# EAGLE design MicrocontrollerBoard_V0.0 (EAGLE 6.4)
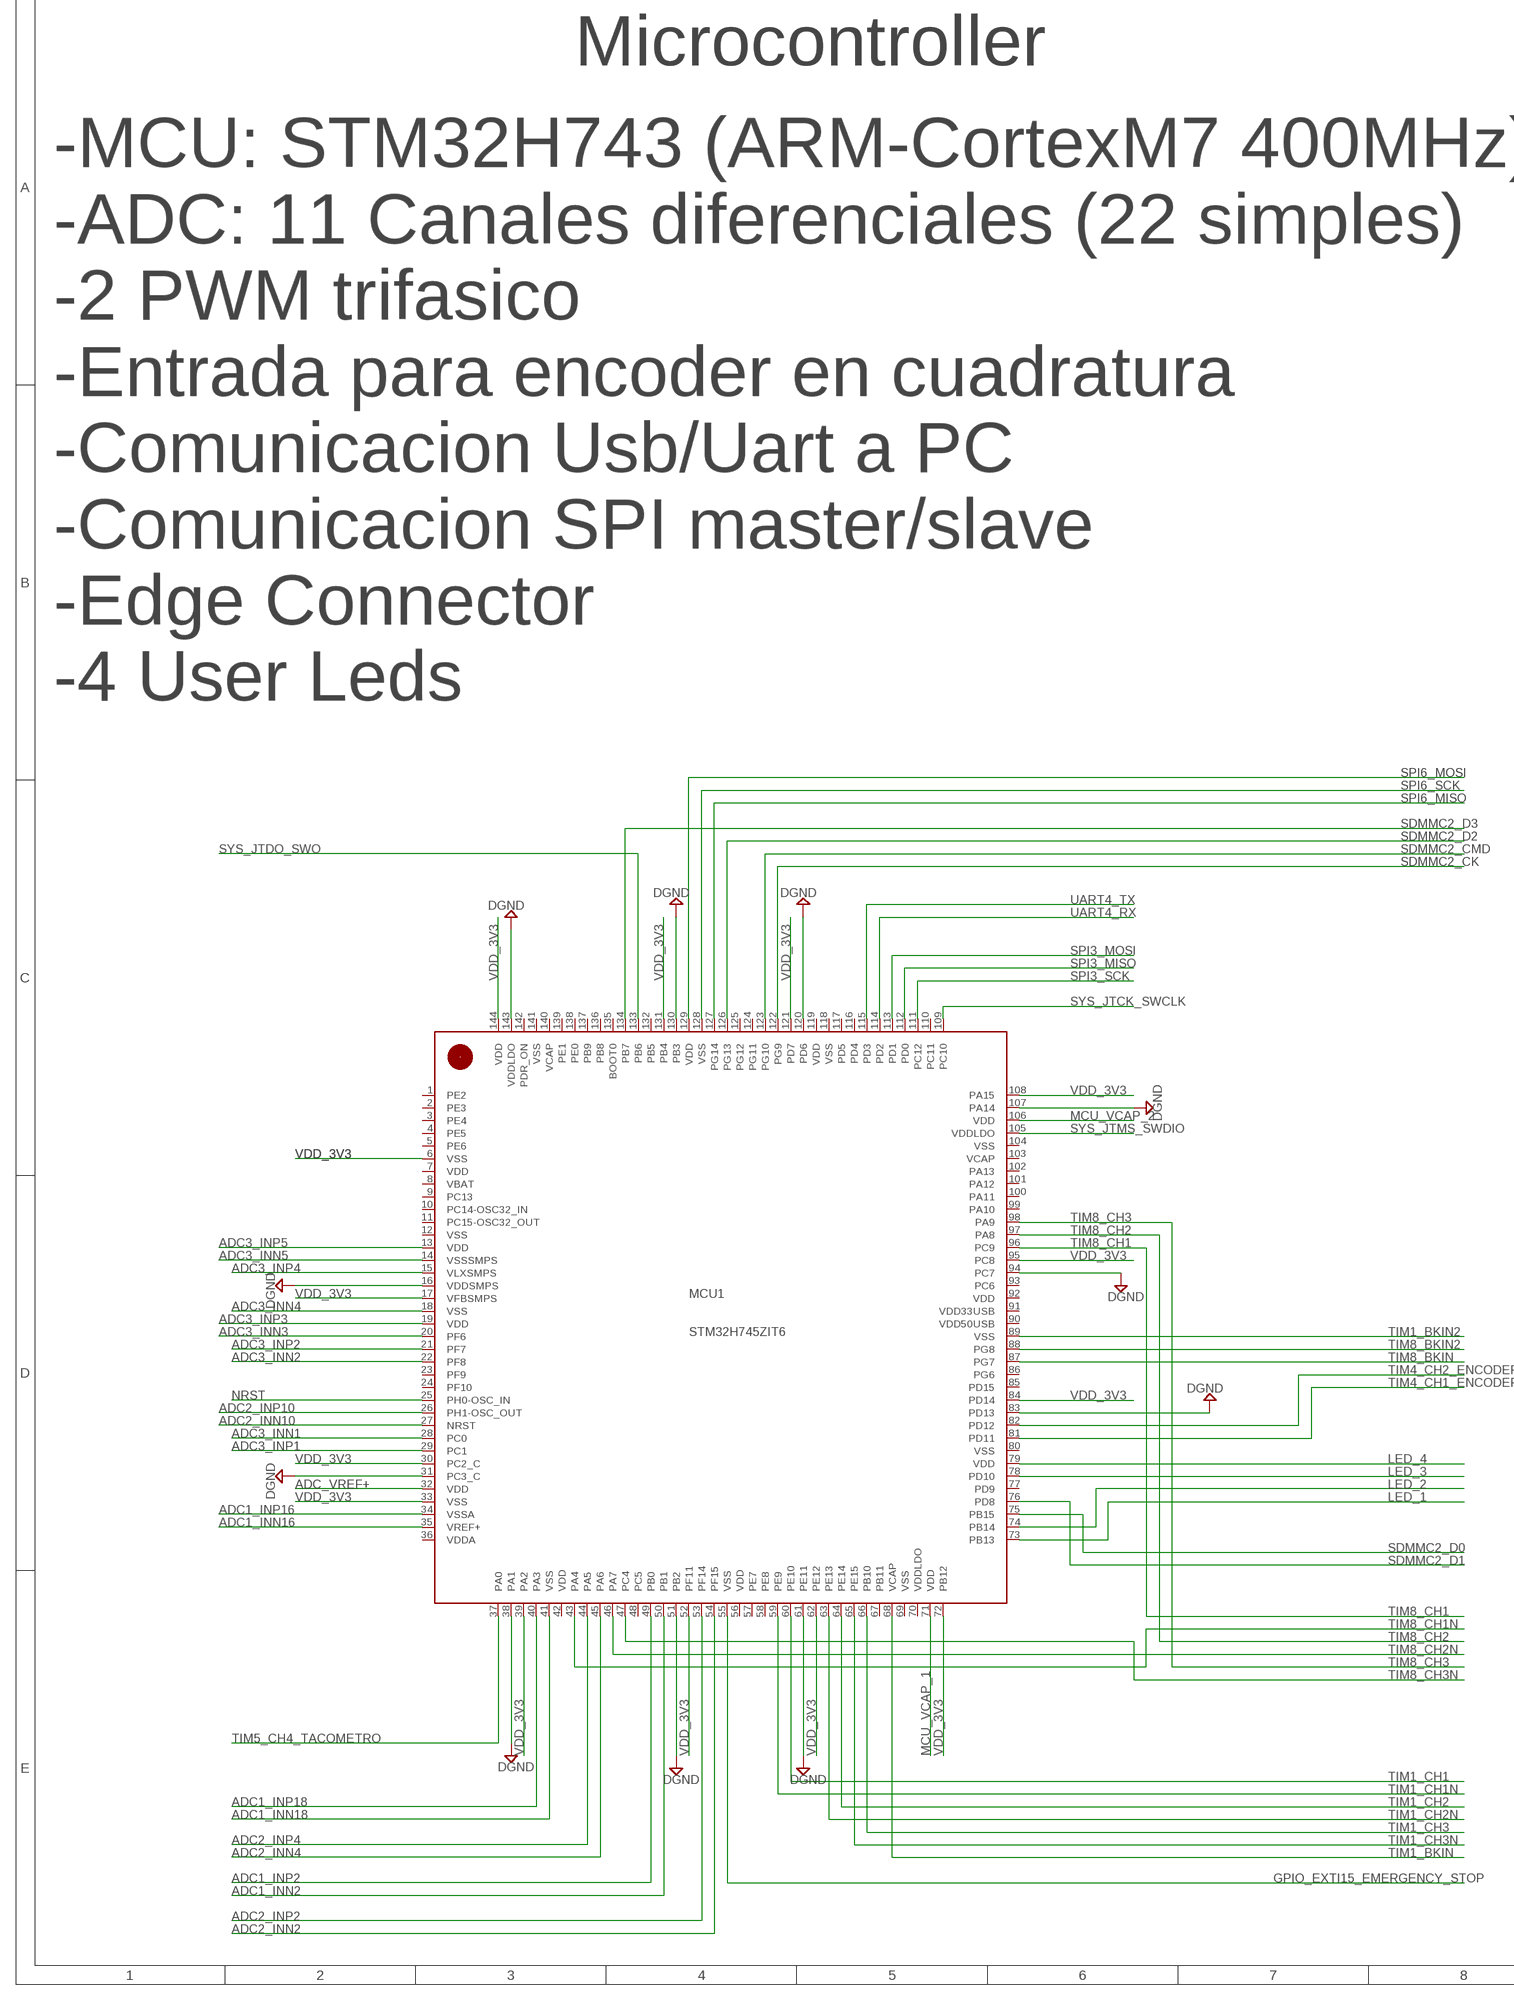
[diagram p0: schematic, sheet 1, part 1 of 2]
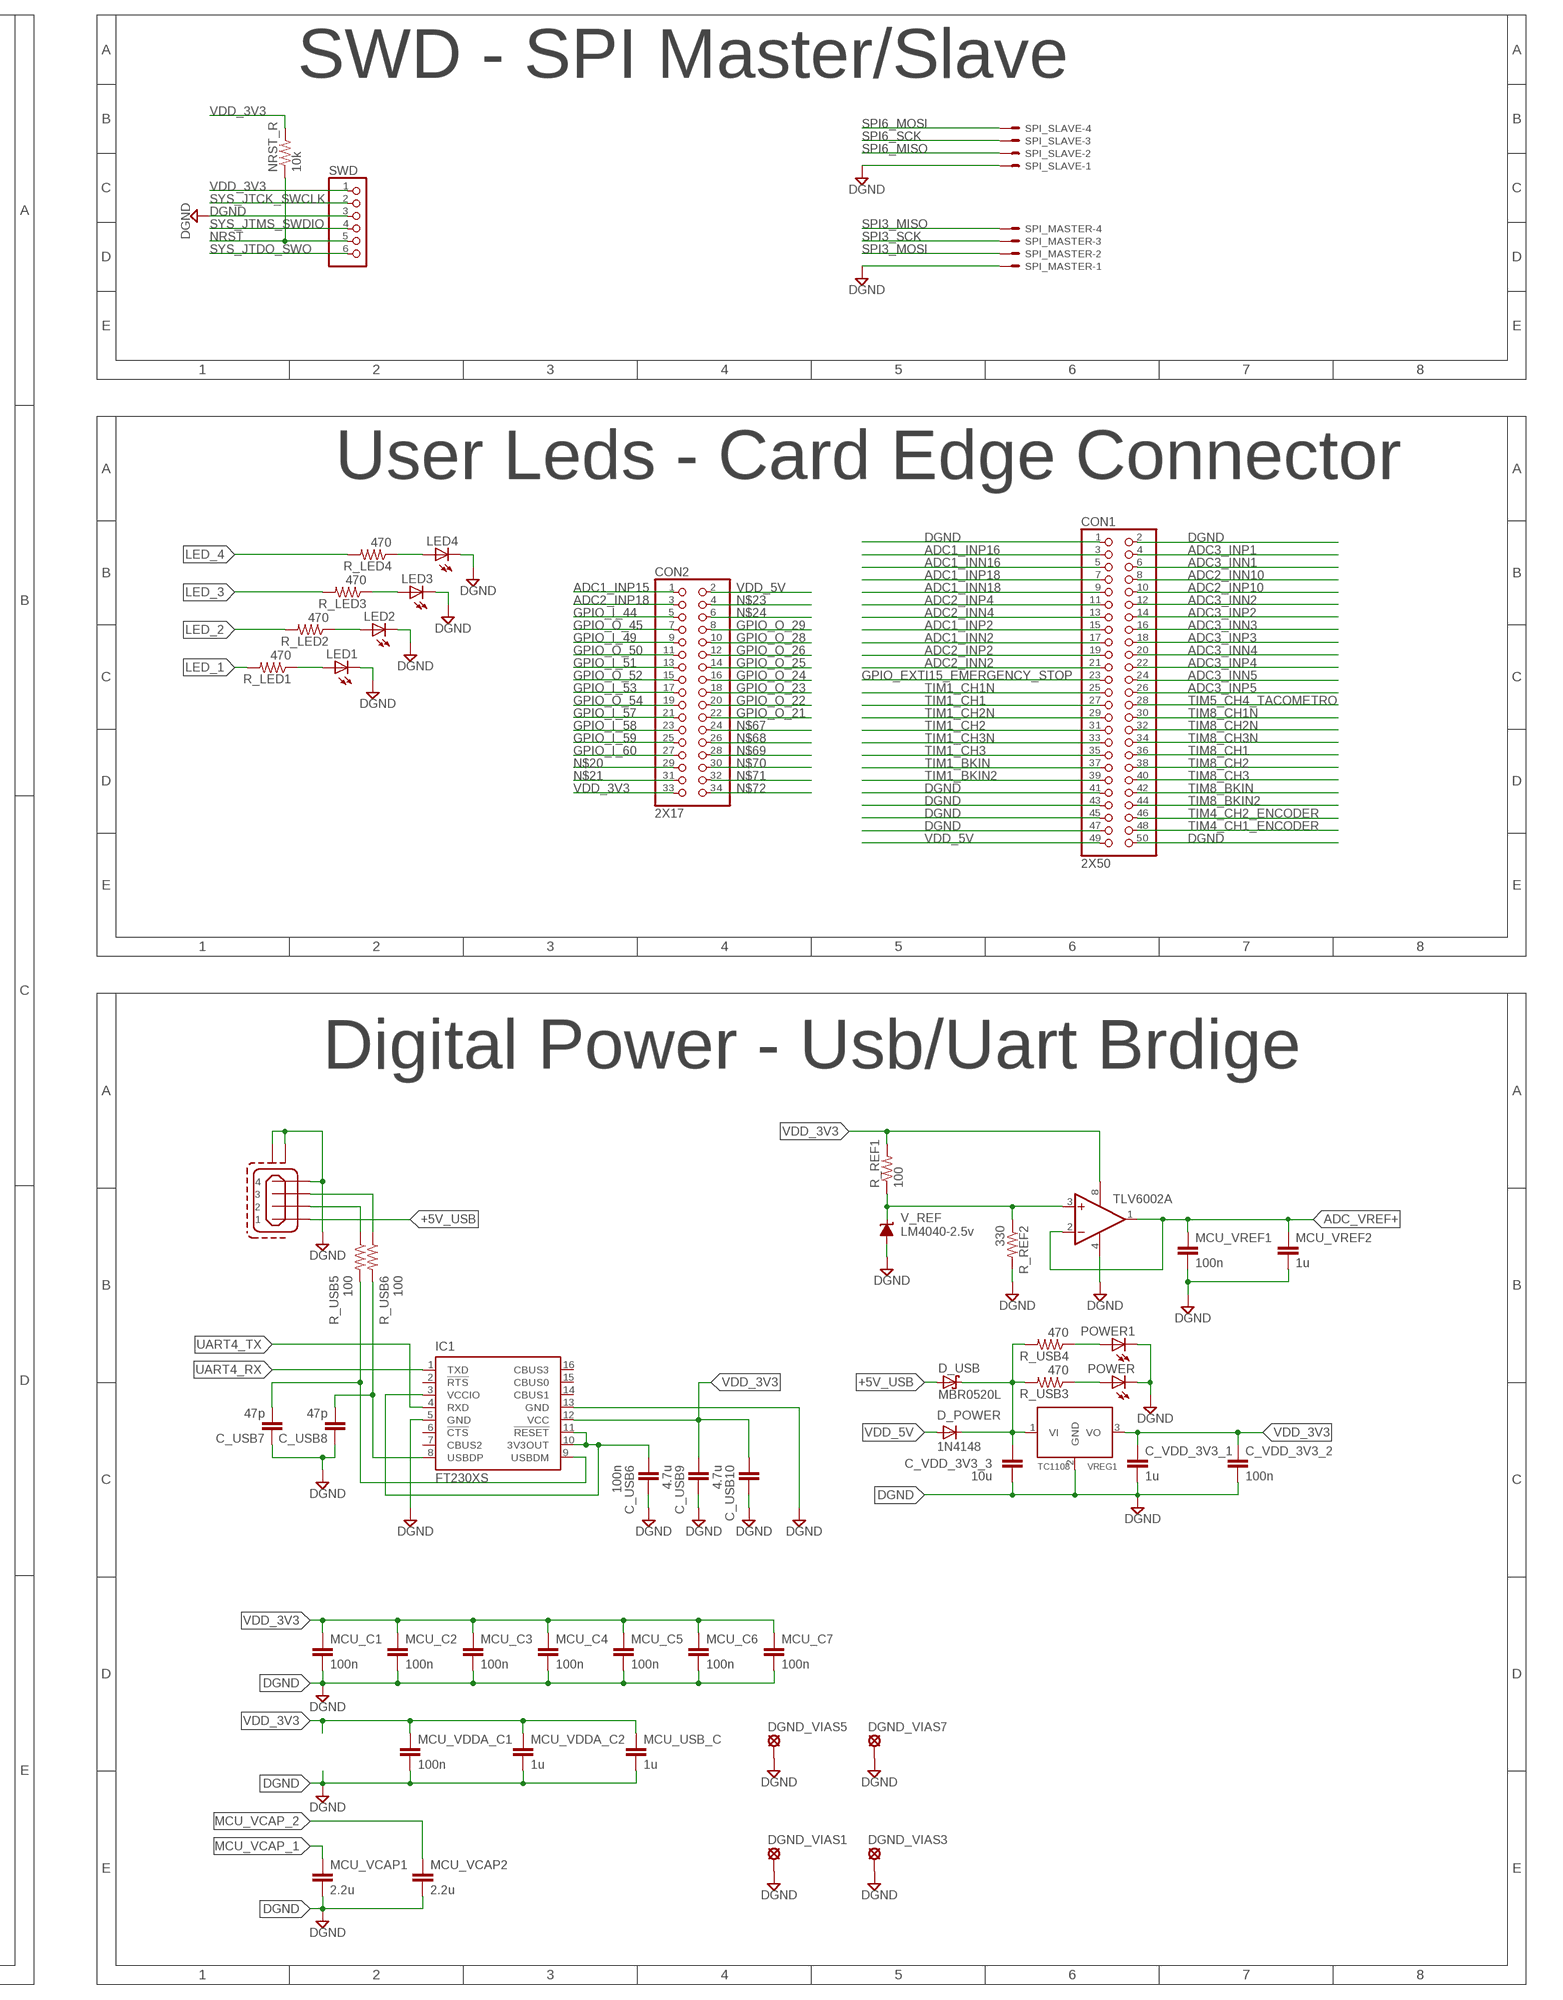
[diagram p1: schematic, sheet 1, part 2 of 2]

## Parts
C_USB6  100n  C-EUC0402  [C0402]
C_USB7  47p  C-EUC0402  [C0402]
C_USB8  47p  C-EUC0402  [C0402]
C_USB9  4.7u  C-EUC0402  [C0402]
C_USB10  4.7u  C-EUC0402  [C0402]
C_VDD_3V3_1  1u  C-EUC0603K  [C0603K]
C_VDD_3V3_2  100n  C-EUC0603K  [C0603K]
C_VDD_3V3_3  10u  C-EUC0603K  [C0603K]
CON1  2X50  [2X25]
CON2  2X17  [2X17]
D_POWER  1N4148  GF1  [SMA-DO214AC]
D_USB  MBR0520L  [SOD-123]
DGND_VIAS1  LSP10  [LSP10]
DGND_VIAS3  LSP10  [LSP10]
DGND_VIAS5  LSP10  [LSP10]
DGND_VIAS7  LSP10  [LSP10]
IC1  FT230XS  [SSOP16]
LED1  LEDCHIPLED_0805  [CHIPLED_0805]
LED2  LEDCHIPLED_0805  [CHIPLED_0805]
LED3  LEDCHIPLED_0805  [CHIPLED_0805]
LED4  LEDCHIPLED_0805  [CHIPLED_0805]
MCU1  STM32H745ZIT6144  [LQFP144]
MCU_C1  100n  C-EUC0402  [C0402]
MCU_C2  100n  C-EUC0402  [C0402]
MCU_C3  100n  C-EUC0402  [C0402]
MCU_C4  100n  C-EUC0402  [C0402]
MCU_C5  100n  C-EUC0402  [C0402]
MCU_C6  100n  C-EUC0402  [C0402]
MCU_C7  100n  C-EUC0402  [C0402]
MCU_USB_C  1u  C-EUC0402  [C0402]
MCU_VCAP1  2.2u  C-EUC0402  [C0402]
MCU_VCAP2  2.2u  C-EUC0402  [C0402]
MCU_VDDA_C1  100n  C-EUC0402  [C0402]
MCU_VDDA_C2  1u  C-EUC0402  [C0402]
MCU_VREF1  100n  C-EUC0402  [C0402]
MCU_VREF2  1u  C-EUC0402  [C0402]
NRST_R  10k  R-US_R0402  [R0402]
POWER  LEDCHIPLED_0805  [CHIPLED_0805]
POWER1  LEDCHIPLED_0805  [CHIPLED_0805]
R_LED1  470  R-US_R0402  [R0402]
R_LED2  470  R-US_R0402  [R0402]
R_LED3  470  R-US_R0402  [R0402]
R_LED4  470  R-US_R0402  [R0402]
R_REF1  100  R-US_R0805  [R0805]
R_REF2  330  R-US_R0805  [R0805]
R_USB3  470  R-US_R0402  [R0402]
R_USB4  470  R-US_R0402  [R0402]
R_USB5  100  R-US_R0402  [R0402]
R_USB6  100  R-US_R0402  [R0402]
SPI_MASTER  22-23-2041  [22-23-2041]
SPI_SLAVE  22-23-2041  [22-23-2041]
SWD  PINHD-1X6/90  [1X06/90]
TLV6002  TL082D  [SO08]
V_REF  LM4040-2.5v  LM4041A12DBZ  [DBZ_R-PDSO-G3]
VREG1  TC1108'SOT-223'  [SOT-223]
X2  MINI-USB_SHIELD4P-85-32004-00X  [85-32004-00X]

## Nets
+5V_USB: D_USB.A(IN) X2.1
ADC1_INN2: CON1.17 MCU1.50(PB1)
ADC1_INN16: CON1.5 MCU1.35(VREF+)
ADC1_INN18: CON1.9 MCU1.41(VSS)
ADC1_INP2: CON1.15 MCU1.49(PB0)
ADC1_INP15: CON2.1
ADC1_INP16: CON1.3 MCU1.34(VSSA)
ADC1_INP18: CON1.7 MCU1.40(PA3)
ADC2_INN2: CON1.21 MCU1.54(PF15)
ADC2_INN4: CON1.13 MCU1.45(PA6)
ADC2_INN10: CON1.8 MCU1.27(NRST)
ADC2_INP2: CON1.19 MCU1.53(PF14)
ADC2_INP4: CON1.11 MCU1.44(PA5)
ADC2_INP10: CON1.10 MCU1.26(PH1-OSC_OUT)
ADC2_INP18: CON2.3
ADC3_INN1: CON1.6 MCU1.28(PC0)
ADC3_INN2: CON1.12 MCU1.22(PF8)
ADC3_INN3: CON1.16 MCU1.20(PF6)
ADC3_INN4: CON1.20 MCU1.18(VSS)
ADC3_INN5: CON1.24 MCU1.14(VSSSMPS)
ADC3_INP1: CON1.4 MCU1.29(PC1)
ADC3_INP2: CON1.14 MCU1.21(PF7)
ADC3_INP3: CON1.18 MCU1.19(VDD)
ADC3_INP4: CON1.22 MCU1.15(VLXSMPS)
ADC3_INP5: CON1.26 MCU1.13(VDD)
ADC_VREF+: MCU1.32(VDD) MCU_VREF1.1 MCU_VREF2.1 TLV6002.1(A:OUT) TLV6002.2(A:-IN)
DGND: C_USB6.1 C_USB7.1 C_USB8.1 C_USB9.1 C_USB10.1 C_VDD_3V3_1.2 C_VDD_3V3_2.2 C_VDD_3V3_3.2 CON1.1 CON1.2 CON1.41 CON1.43 CON1.45 CON1.47 CON1.50 DGND_VIAS1.MP DGND_VIAS3.MP DGND_VIAS5.MP DGND_VIAS7.MP IC1.5(GND) IC1.13(GND) LED1.C LED2.C LED3.C LED4.C MCU1.16(VDDSMPS) MCU1.31(PC3_C) MCU1.38(PA1) MCU1.51(PB2) MCU1.61(PE11) MCU1.83(PD13) MCU1.94(PC7) MCU1.107(PA14) MCU1.120(PD6) MCU1.130(PB3) MCU1.143(VDDLDO) MCU_C1.2 MCU_C2.2 MCU_C3.2 MCU_C4.2 MCU_C5.2 MCU_C6.2 MCU_C7.2 MCU_USB_C.2 MCU_VCAP1.2 MCU_VCAP2.2 MCU_VDDA_C1.2 MCU_VDDA_C2.2 MCU_VREF1.2 MCU_VREF2.2 POWER1.C POWER.C R_REF2.2 SPI_MASTER.1 SPI_SLAVE.1 SWD.3 TLV6002.4(P:V-) V_REF.2(A) VREG1.2(GND) X2.4 X2.M1(S1) X2.M2(S2)
GPIO_EXTI15_EMERGENCY_STOP: CON1.23 MCU1.55(VSS)
GPIO_I_44: CON2.5
GPIO_I_49: CON2.9
GPIO_I_51: CON2.13
GPIO_I_53: CON2.17
GPIO_I_57: CON2.21
GPIO_I_58: CON2.23
GPIO_I_59: CON2.25
GPIO_I_60: CON2.27
GPIO_O_21: CON2.22
GPIO_O_22: CON2.20
GPIO_O_23: CON2.18
GPIO_O_24: CON2.16
GPIO_O_25: CON2.14
GPIO_O_26: CON2.12
GPIO_O_28: CON2.10
GPIO_O_29: CON2.8
GPIO_O_45: CON2.7
GPIO_O_50: CON2.11
GPIO_O_52: CON2.15
GPIO_O_54: CON2.19
LED_1: MCU1.73(PB13) R_LED1.2
LED_2: MCU1.74(PB14) R_LED2.2
LED_3: MCU1.78(PD10) R_LED3.2
LED_4: MCU1.79(VDD) R_LED4.2
MCU_VCAP_1: MCU1.71(VDD) MCU_VCAP1.1
MCU_VCAP_2: MCU1.106(VDD) MCU_VCAP2.1
N$2: LED4.A R_LED4.1
N$7: POWER1.A R_USB4.1
N$11: LED3.A R_LED3.1
N$12: C_USB6.2 IC1.3(VCCIO) IC1.10(3V3OUT) IC1.11(!RESET)
N$15: C_VDD_3V3_3.1 D_POWER.K(C) D_USB.C(OUT) R_USB3.2 R_USB4.2 VREG1.1(VI)
N$16: C_USB8.2 IC1.8(USBDP) R_USB6.2
N$17: C_USB7.2 IC1.9(USBDM) R_USB5.2
N$20: CON2.29
N$21: CON2.31
N$23: CON2.4
N$24: CON2.6
N$67: CON2.24
N$68: CON2.26
N$69: CON2.28
N$70: CON2.30
N$71: CON2.32
N$72: CON2.34
N$133: R_USB5.1 X2.2
N$134: R_USB6.1 X2.3
N$138: POWER.A R_USB3.1
N$144: R_REF1.1 R_REF2.1 TLV6002.3(A:+IN) V_REF.1(C)
N$147: LED1.A R_LED1.1
N$154: LED2.A R_LED2.1
NRST: MCU1.25(PH0-OSC_IN) NRST_R.1 SWD.5
SDMMC2_CK: MCU1.122(PG9)
SDMMC2_CMD: MCU1.123(PG10)
SDMMC2_D0: MCU1.75(PB15)
SDMMC2_D1: MCU1.76(PD8)
SDMMC2_D2: MCU1.126(PG13)
SDMMC2_D3: MCU1.134(PB7)
SPI3_MISO: MCU1.112(PD0) SPI_MASTER.4
SPI3_MOSI: MCU1.113(PD1) SPI_MASTER.2
SPI3_SCK: MCU1.111(PC12) SPI_MASTER.3
SPI6_MISO: MCU1.127(PG14) SPI_SLAVE.2
SPI6_MOSI: MCU1.129(VDD) SPI_SLAVE.4
SPI6_SCK: MCU1.128(VSS) SPI_SLAVE.3
SYS_JTCK_SWCLK: MCU1.109(PC10) SWD.2
SYS_JTDO_SWO: MCU1.133(PB6) SWD.6
SYS_JTMS_SWDIO: MCU1.105(VDDLDO) SWD.4
TIM1_BKIN: CON1.37 MCU1.68(VCAP)
TIM1_BKIN2: CON1.39 MCU1.89(VSS)
TIM1_CH1: CON1.27 MCU1.60(PE10)
TIM1_CH1N: CON1.25 MCU1.59(PE9)
TIM1_CH2: CON1.31 MCU1.64(PE14)
TIM1_CH2N: CON1.29 MCU1.63(PE13)
TIM1_CH3: CON1.35 MCU1.66(PB10)
TIM1_CH3N: CON1.33 MCU1.65(PE15)
TIM4_CH1_ENCODER: CON1.48 MCU1.81(PD11)
TIM4_CH2_ENCODER: CON1.46 MCU1.82(PD12)
TIM5_CH4_TACOMETRO: CON1.28 MCU1.37(PA0)
TIM8_BKIN: CON1.42 MCU1.87(PG7)
TIM8_BKIN2: CON1.44 MCU1.88(PG8)
TIM8_CH1: CON1.36 MCU1.96(PC9)
TIM8_CH1N: CON1.30 MCU1.43(PA4)
TIM8_CH2: CON1.38 MCU1.97(PA8)
TIM8_CH2N: CON1.32 MCU1.46(PA7)
TIM8_CH3: CON1.40 MCU1.98(PA9)
TIM8_CH3N: CON1.34 MCU1.47(PC4)
UART4_RX: IC1.1(TXD) MCU1.114(PD2)
UART4_TX: IC1.4(RXD) MCU1.115(PD3)
VDD_3V3: C_USB9.2 C_USB10.2 C_VDD_3V3_1.1 C_VDD_3V3_2.1 CON2.33 IC1.12(VCC) MCU1.6(VSS) MCU1.17(VFBSMPS) MCU1.30(PC2_C) MCU1.33(VSS) MCU1.39(PA2) MCU1.52(PF11) MCU1.62(PE12) MCU1.72(PB12) MCU1.84(PD14) MCU1.95(PC8) MCU1.108(PA15) MCU1.121(PD7) MCU1.131(PB4) MCU1.144(VDD) MCU_C1.1 MCU_C2.1 MCU_C3.1 MCU_C4.1 MCU_C5.1 MCU_C6.1 MCU_C7.1 MCU_USB_C.1 MCU_VDDA_C1.1 MCU_VDDA_C2.1 NRST_R.2 R_REF1.2 SWD.1 TLV6002.8(P:V+) VREG1.3(VO)
VDD_5V: CON1.49 CON2.2 D_POWER.A
Unconnected: IC1.2(!RTS) IC1.6(!CTS) IC1.7(CBUS2) IC1.14(CBUS1) IC1.15(CBUS0) IC1.16(CBUS3) MCU1.1(PE2) MCU1.2(PE3) MCU1.3(PE4) MCU1.4(PE5) MCU1.5(PE6) MCU1.7(VDD) MCU1.8(VBAT) MCU1.9(PC13) MCU1.10(PC14-OSC32_IN) MCU1.11(PC15-OSC32_OUT) MCU1.12(VSS) MCU1.23(PF9) MCU1.24(PF10) MCU1.36(VDDA) MCU1.42(VDD) MCU1.48(PC5) MCU1.56(VDD) MCU1.57(PE7) MCU1.58(PE8) MCU1.67(PB11) MCU1.69(VSS) MCU1.70(VDDLDO) MCU1.77(PD9) MCU1.80(VSS) MCU1.85(PD15) MCU1.86(PG6) MCU1.90(VDD50USB) MCU1.91(VDD33USB) MCU1.92(VDD) MCU1.93(PC6) MCU1.99(PA10) MCU1.100(PA11) MCU1.101(PA12) MCU1.102(PA13) MCU1.103(VCAP) MCU1.104(VSS) MCU1.110(PC11) MCU1.116(PD4) MCU1.117(PD5) MCU1.118(VSS) MCU1.119(VDD) MCU1.124(PG11) MCU1.125(PG12) MCU1.132(PB5) MCU1.135(BOOT0) MCU1.136(PB8) MCU1.137(PB9) MCU1.138(PE0) MCU1.139(PE1) MCU1.140(VCAP) MCU1.141(VSS) MCU1.142(PDR_ON) TLV6002.5(B:+IN) TLV6002.6(B:-IN) TLV6002.7(B:OUT)

## Notes on the sheet
- Microcontroller | SWD - SPI Master/Slave
- User Leds - Card Edge Connector
- -MCU: STM32H743 (ARM-CortexM7 400MHz)
  -ADC: 11 Canales diferenciales (22 simples)
  -2 PWM trifasico
  -Entrada para encoder en cuadratura
  -Comunicacion Usb/Uart a PC
  -Comunicacion SPI master/slave
  -Edge Connector
  -4 User Leds
- Digital Power - Usb/Uart Brdige

## Library data of the parts
C_USB6-C_USB10 C_VDD_3V3_1-C_VDD_3V3_3 MCU_C1-MCU_C7 MCU_USB_C MCU_VCAP1 MCU_VCAP2 MCU_VDDA_C1 MCU_VDDA_C2 MCU_VREF1 MCU_VREF2 = rcl:C-EU: CAPACITOR, European symbol
CON1 = CardEdgePads:2X50
CON2 = CardEdgePads:2X17
D_POWER = diode:GF1: DIODE
D_USB = MBR:MBR0520L: The MBR0520L is a Schottky Rectifier whit Low Forward Voltage.
DGND_VIAS1 DGND_VIAS3 DGND_VIAS5 DGND_VIAS7 = solpad:LSP10: SOLDER PAD drill 1.0 mm, distributor Buerklin, 12H555
IC1 = ftdichip:FT230X: USB to BASIC UART IC Auto generated by make-symbol-device-package-bsdl.ulp Rev. 43 Source: Data sheet <http://www.ftdichip.com/Support/Documents/DataSheets/ICs/DS_FT230X.pdf>
LED1-LED4 POWER POWER1 = led:LED: LED OSRAM: - CHIPLED LG R971, LG N971, LY N971, LG Q971, LY Q971, LO R971, LY R971 LH N974, LH R974 LS Q976, LO Q976, LY Q976 LO Q996 - Hyper CHIPLED LW Q18S LB Q993, LB Q99A, LB R99A - SideLED LS A670, LO A670, LY A670, LG A670, LP A670 LB A673, LV A673, LT A673, LW A673 LH A674 LY A675 LS A676, LA A676, LO A676, LY A676, LW A676 LS A679, LY A679, LG A679 - Hyper Micro SIDELED® LS Y876, LA Y876, LO Y876, LY Y876 LT Y87S - SmartLED LW L88C, LW L88S LB L89C, LB L89S, LG L890 LS L89K, LO L89K, LY L89K LS L896, LA L896, LO L896, LY L896 - TOPLED LS T670, LO T670, LY T670, LG T670, LP T670 LSG T670, LSP T670, LSY T670, LOP T670, LYG T670 LG T671, LOG T671, LSG T671 LB T673, LV T673, LT T673, LW T673 LH T674 LS T676, LA T676, LO T676, LY T676, LB T676, LH T676, LSB T676, LW T676 LB T67C, LV T67C, LT T67C, LS T67K, LO T67K, LY T67K, LW E67C LS E67B, LA E67B, LO E67B, LY E67B, LB E67C, LV E67C, LT E67C LW T67C LS T679, LY T679, LG T679 LS T770, LO T770, LY T770, LG T770, LP T770 LB T773, LV T773, LT T773, LW T773 LH T774 LS E675, LA E675, LY E675, LS T675 LS T776, LA T776, LO T776, LY T776, LB T776 LHGB T686 LT T68C, LB T68C - Hyper Mini TOPLED® LB M676 - Mini TOPLED Santana® LG M470 LS M47K, LO M47K, LY M47K Source: http://www.osram.convergy.de LUXEON: - LUMILED® LXK2-PW12-R00, LXK2-PW12-S00, LXK2-PW14-U00, LXK2-PW14-V00 LXK2-PM12-R00, LXK2-PM12-S00, LXK2-PM14-U00 LXK2-PE12-Q00, LXK2-PE12-R00, LXK2-PE12-S00, LXK2-PE14-T00, LXK2-PE14-U00 LXK2-PB12-K00, LXK2-PB12-L00, LXK2-PB12-M00, LXK2-PB14-N00, LXK2-PB14-P00, LXK2-PB14-Q00 LXK2-PR12-L00, LXK2-PR12-M00, LXK2-PR14-Q00, LXK2-PR14-R00 LXK2-PD12-Q00, LXK2-PD12-R00, LXK2-PD12-S00 LXK2-PH12-R00, LXK2-PH12-S00 LXK2-PL12-P00, LXK2-PL12-Q00, LXK2-PL12-R00 Source: www.luxeon.com KINGBRIGHT: KA-3528ASYC Source: www.kingbright.com
MCU1 = STM32H745ZIT6:STM32H745ZIT6
NRST_R R_LED1-R_LED4 R_REF1 R_REF2 R_USB3-R_USB6 = rcl:R-US_: RESISTOR, American symbol
SPI_MASTER SPI_SLAVE = con-molex:22-23-2041: .100" (2.54mm) Center Header - 4 Pin; MF: MOLEX; MPN: 22-23-2041; OC_FARNELL: 1462920; OC_NEWARK: 38C0355
SWD = pinhead:PINHD-1X6: PIN HEADER
TLV6002 = linear:TL082: OP AMP
V_REF = texas:LM4041: PRECISION MICROPOWER SHUNT VOLTAGE REFERENCE Source: http://focus.ti.com/lit/ds/slcs146e/slcs146e.pdf; MPN: LM4041A12IDBZR; OC_FARNELL: 1407949; OC_NEWARK: 58K5875
VREG1 = TC1108:TC1108
X2 = con-cypressindustries:MINI-USB_SHIELD4P-: MINI USB 4 Pol. Source: www.cypressindustries.com; OC_FARNELL: unknown; OC_NEWARK: unknown

## Board
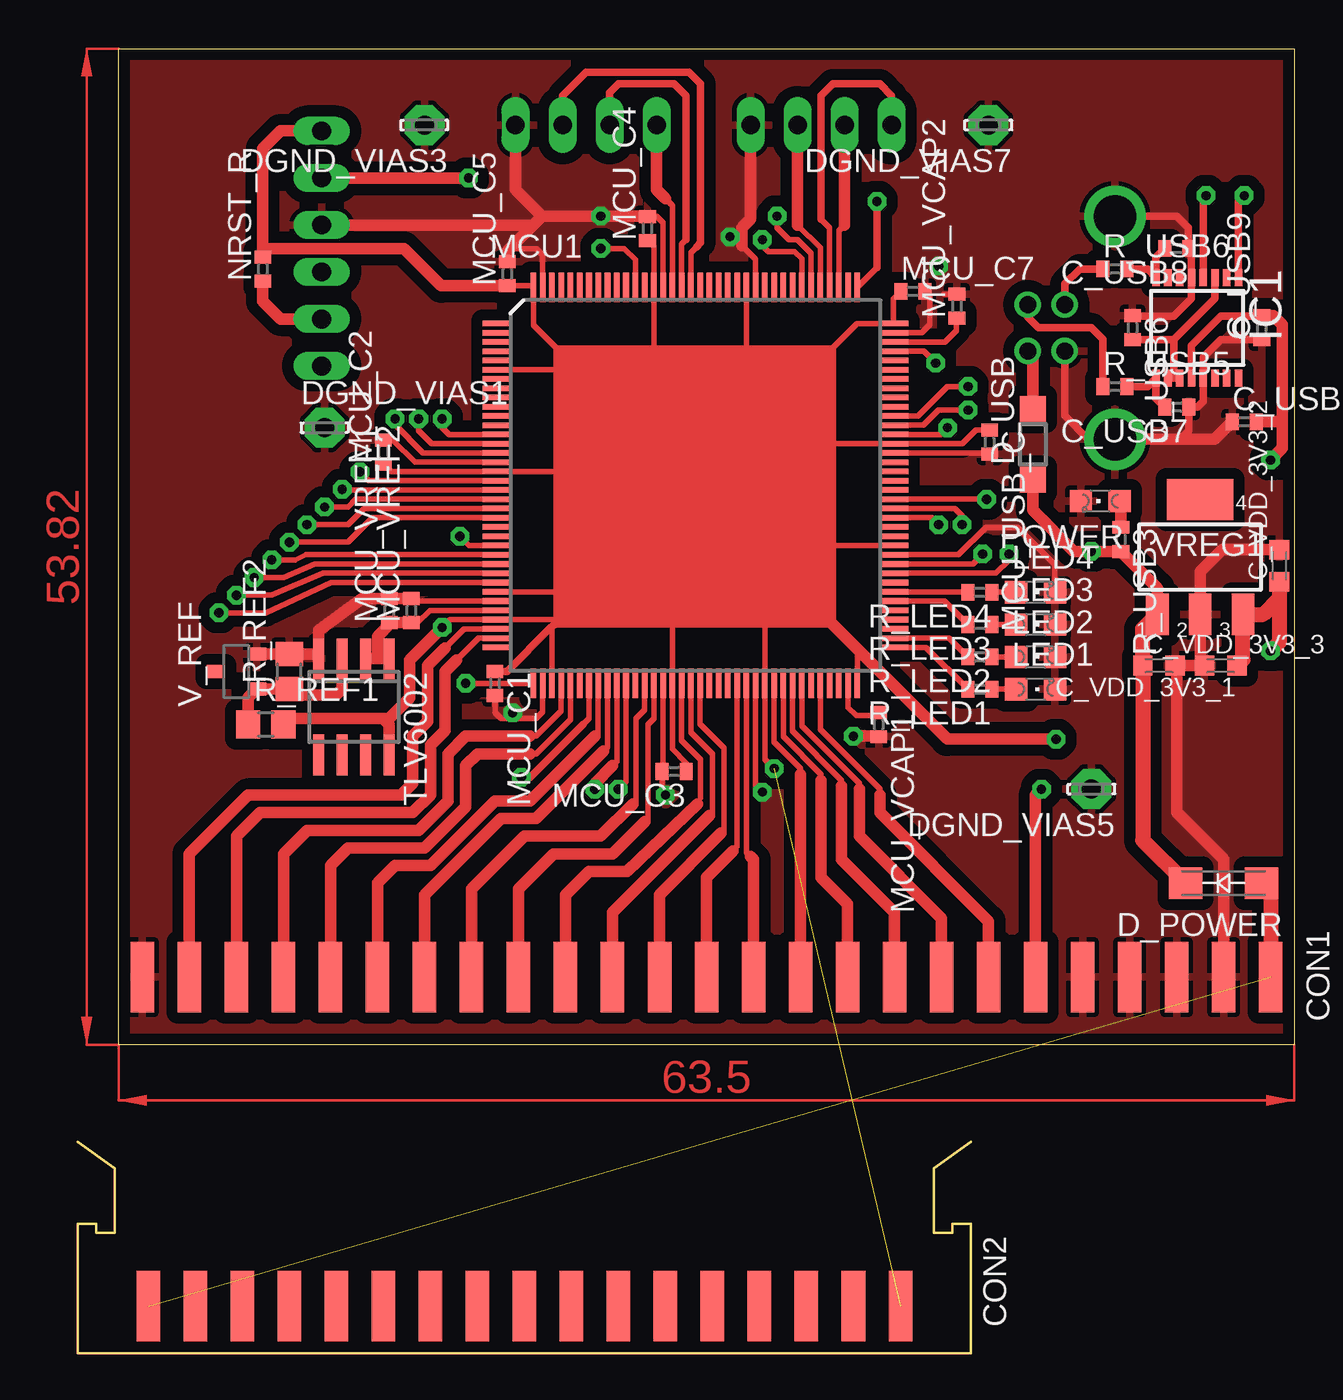
[diagram p2: board, top side]
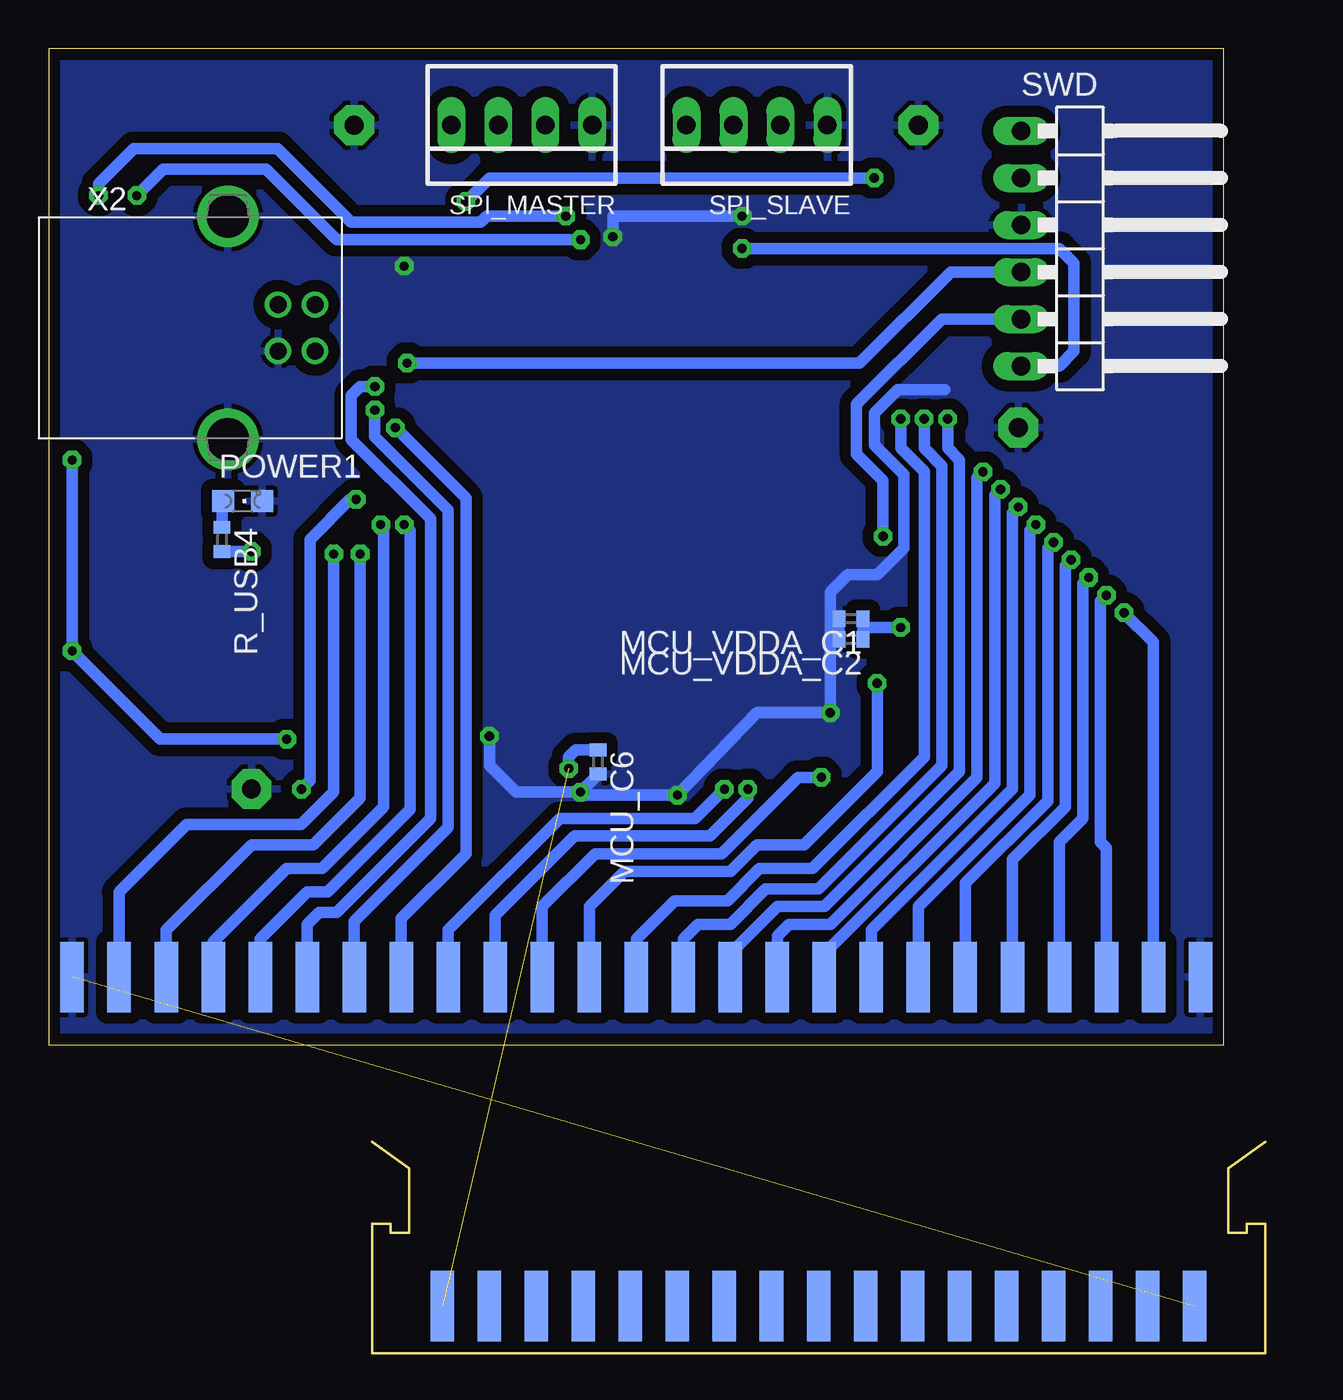
[diagram p3: board, bottom side, seen from below]

Size 63.5 x 53.82 mm. Coordinates in mm from the lower left corner, seen from the top.
Outline: 0,0 0,53.82 63.5,53.82 63.5,0 0,0
Copper layers (1*16): Top 0.035mm / dielectric 1.5mm / Bottom 0.035mm
Design rules "mayer_estandar": minimum track width 5mil, minimum drill 16mil, track to track 5mil, track to pad 5mil, pad to pad 8mil, via to via 8mil, smd to smd 8mil, copper to edge 12mil, drill to drill 8mil, minimum pad ring 10mil, minimum via ring 8mil, stop-mask expansion 4mil, vias tented up to drill 0mil, thermal gap 10mil

### Footprints (pad centres in the part's own frame; a part is rotated, then mirrored left to right if it is on the bottom)
C0402 = smd 0.7 x 0.9: 1 -0.65,0; 2 0.65,0
C0603K = smd 1.05 x 1.08: 1 -0.875,0; 2 0.875,0
2X25 = smd 1.27 x 3.81: 1 -30.48,0; 3 -27.94,0; 5 -25.4,0; 7 -22.86,0; 9 -20.32,0; 11 -17.78,0; 13 -15.24,0; 15 -12.7,0; 17 -10.16,0; 19 -7.62,0; 21 -5.08,0; 23 -2.54,0; 25 0,0; 27 2.54,0; 29 5.08,0; 31 7.62,0; 33 10.16,0; 35 12.7,0; 37 15.24,0; 39 17.78,0; 41 20.32,0; 43 22.86,0; 45 25.4,0; 47 27.94,0; 49 30.48,0 | smd 1.27 x 3.81 bottom: 2 -30.48,0; 4 -27.94,0; 6 -25.4,0; 8 -22.86,0; 10 -20.32,0; 12 -17.78,0; 14 -15.24,0; 16 -12.7,0; 18 -10.16,0; 20 -7.62,0; 22 -5.08,0; 24 -2.54,0; 26 0,0; 28 2.54,0; 30 5.08,0; 32 7.62,0; 34 10.16,0; 36 12.7,0; 38 15.24,0; 40 17.78,0; 42 20.32,0; 44 22.86,0; 46 25.4,0; 48 27.94,0; 50 30.48,0
2X17 = smd 1.27 x 3.81: 1 -20.32,0; 3 -17.78,0; 5 -15.24,0; 7 -12.7,0; 9 -10.16,0; 11 -7.62,0; 13 -5.08,0; 15 -2.54,0; 17 0,0; 19 2.54,0; 21 5.08,0; 23 7.62,0; 25 10.16,0; 27 12.7,0; 29 15.24,0; 31 17.78,0; 33 20.32,0 | smd 1.27 x 3.81 bottom: 2 -20.32,0; 4 -17.78,0; 6 -15.24,0; 8 -12.7,0; 10 -10.16,0; 12 -7.62,0; 14 -5.08,0; 16 -2.54,0; 18 0,0; 20 2.54,0; 22 5.08,0; 24 7.62,0; 26 10.16,0; 28 12.7,0; 30 15.24,0; 32 17.78,0; 34 20.32,0
SMA-DO214AC = smd 1.8 x 1.7: A -2.05,0; K 2.05,0
SOD-123 = smd 1.4 x 1.4: A 1.8,0; C -2,0
LSP10 = drill 1.016 pad 2.159 octagon: MP 0,0
SSOP16 = smd 0.914 x 0.406: 1 -2.718,2.223; 2 -2.718,1.587; 3 -2.718,0.953; 4 -2.718,0.318; 5 -2.718,-0.318; 6 -2.718,-0.953; 7 -2.718,-1.587; 8 -2.718,-2.223; 9 2.718,-2.223; 10 2.718,-1.587; 11 2.718,-0.953; 12 2.718,-0.318; 13 2.718,0.318; 14 2.718,0.953; 15 2.718,1.587; 16 2.718,2.223
CHIPLED_0805 = smd 1.2 x 1.2: A 0,-1.05; C 0,1.05
LQFP144 = smd 1.6 x 0.3: 1 -10.7,8.75; 2 -10.7,8.25; 3 -10.7,7.75; 4 -10.7,7.25; 5 -10.7,6.75; 6 -10.7,6.25; 7 -10.7,5.75; 8 -10.7,5.25; 9 -10.7,4.75; 10 -10.7,4.25; 11 -10.7,3.75; 12 -10.7,3.25; 13 -10.7,2.75; 14 -10.7,2.25; 15 -10.7,1.75; 16 -10.7,1.25; 17 -10.7,0.75; 18 -10.7,0.25; 19 -10.7,-0.25; 20 -10.7,-0.75; 21 -10.7,-1.25; 22 -10.7,-1.75; 23 -10.7,-2.25; 24 -10.7,-2.75; 25 -10.7,-3.25; 26 -10.7,-3.75; 27 -10.7,-4.25; 28 -10.7,-4.75; 29 -10.7,-5.25; 30 -10.7,-5.75; 31 -10.7,-6.25; 32 -10.7,-6.75; 33 -10.7,-7.25; 34 -10.7,-7.75; 35 -10.7,-8.25; 36 -10.7,-8.75; 73 10.7,-8.75; 74 10.7,-8.25; 75 10.7,-7.75; 76 10.7,-7.25; 77 10.7,-6.75; 78 10.7,-6.25; 79 10.7,-5.75; 80 10.7,-5.25; 81 10.7,-4.75; 82 10.7,-4.25; 83 10.7,-3.75; 84 10.7,-3.25; 85 10.7,-2.75; 86 10.7,-2.25; 87 10.7,-1.75; 88 10.7,-1.25; 89 10.7,-0.75; 90 10.7,-0.25; 91 10.7,0.25; 92 10.7,0.75; 93 10.7,1.25; 94 10.7,1.75; 95 10.7,2.25; 96 10.7,2.75; 97 10.7,3.25; 98 10.7,3.75; 99 10.7,4.25; 100 10.7,4.75; 101 10.7,5.25; 102 10.7,5.75; 103 10.7,6.25; 104 10.7,6.75; 105 10.7,7.25; 106 10.7,7.75; 107 10.7,8.25; 108 10.7,8.75 | smd 0.3 x 1.6: 37 -8.75,-10.7; 38 -8.25,-10.7; 39 -7.75,-10.7; 40 -7.25,-10.7; 41 -6.75,-10.7; 42 -6.25,-10.7; 43 -5.75,-10.7; 44 -5.25,-10.7; 45 -4.75,-10.7; 46 -4.25,-10.7; 47 -3.75,-10.7; 48 -3.25,-10.7; 49 -2.75,-10.7; 50 -2.25,-10.7; 51 -1.75,-10.7; 52 -1.25,-10.7; 53 -0.75,-10.7; 54 -0.25,-10.7; 55 0.25,-10.7; 56 0.75,-10.7; 57 1.25,-10.7; 58 1.75,-10.7; 59 2.25,-10.7; 60 2.75,-10.7; 61 3.25,-10.7; 62 3.75,-10.7; 63 4.25,-10.7; 64 4.75,-10.7; 65 5.25,-10.7; 66 5.75,-10.7; 67 6.25,-10.7; 68 6.75,-10.7; 69 7.25,-10.7; 70 7.75,-10.7; 71 8.25,-10.7; 72 8.75,-10.7; 109 8.75,10.7; 110 8.25,10.7; 111 7.75,10.7; 112 7.25,10.7; 113 6.75,10.7; 114 6.25,10.7; 115 5.75,10.7; 116 5.25,10.7; 117 4.75,10.7; 118 4.25,10.7; 119 3.75,10.7; 120 3.25,10.7; 121 2.75,10.7; 122 2.25,10.7; 123 1.75,10.7; 124 1.25,10.7; 125 0.75,10.7; 126 0.25,10.7; 127 -0.25,10.7; 128 -0.75,10.7; 129 -1.25,10.7; 130 -1.75,10.7; 131 -2.25,10.7; 132 -2.75,10.7; 133 -3.25,10.7; 134 -3.75,10.7; 135 -4.25,10.7; 136 -4.75,10.7; 137 -5.25,10.7; 138 -5.75,10.7; 139 -6.25,10.7; 140 -6.75,10.7; 141 -7.25,10.7; 142 -7.75,10.7; 143 -8.25,10.7; 144 -8.75,10.7
R0402 = smd 0.7 x 0.9: 1 -0.65,0; 2 0.65,0
R0805 = smd 1.3 x 1.5: 1 -0.95,0; 2 0.95,0
22-23-2041 = drill 1 long: 1 -3.81,0; 2 -1.27,0; 3 1.27,0; 4 3.81,0
1X06/90 = drill 1.016 long: 1 -6.35,-3.81; 2 -3.81,-3.81; 3 -1.27,-3.81; 4 1.27,-3.81; 5 3.81,-3.81; 6 6.35,-3.81
SO08 = smd 0.6 x 2.2: 1 -1.905,-2.6; 2 -0.635,-2.6; 3 0.635,-2.6; 4 1.905,-2.6; 5 1.905,2.6; 6 0.635,2.6; 7 -0.635,2.6; 8 -1.905,2.6
DBZ_R-PDSO-G3 = smd 0.7 x 1: 1 -0.95,-1.1; 2 0.95,-1.1; 3 0,1.1
SOT-223 = smd 1.219 x 2.235: 1 -2.311,-3.099; 2 0,-3.099; 3 2.311,-3.099 | smd 3.6 x 2.2: 4 0,3.099
85-32004-00X = drill 0.92 pad 1.27: 1 4.71,-1.25; 2 4.71,1.25; 3 2.71,1.25; 4 2.71,-1.25 | drill 2.3 pad 3: M1 0,6.02; M2 0,-6.02

### Placement (x,y rotation side)
C_USB6  54.77,38.73 270 top
C_USB7  57.15,34.45 180 top
C_USB8  57.15,43.02 180 top
C_USB9  61.75,38.73 90 top
C_USB10  60.8,33.66 0 top
C_VDD_3V3_1  59.53,20.48 180 top
C_VDD_3V3_2  62.71,25.88 90 top
C_VDD_3V3_3  56.2,20.48 0 top
CON1  31.75,3.65 0 top
CON2  21.91,-14.13 0 top  (outside the outline)
D_POWER  59.69,8.73 180 top
D_USB  49.37,32.54 90 top
DGND_VIAS1  11.11,33.34 0 top
DGND_VIAS3  16.51,49.69 180 top
DGND_VIAS5  52.55,13.81 180 top
DGND_VIAS7  46.99,49.69 180 top
IC1  58.26,38.73 270 top
LED1  49.53,19.21 270 top
LED2  49.53,20.95 270 top
LED3  49.53,22.7 270 top
LED4  49.53,24.45 270 top
MCU1  31.15,30.22 0 top
MCU_C1  20.32,19.53 270 top
MCU_C2  14.3,32.03 90 top
MCU_C3  30,14.76 180 top
MCU_C4  28.56,44.1 90 top
MCU_C5  20.99,41.65 90 top
MCU_C6  33.81,15.28 270 bottom
MCU_C7  42.9,40.7 0 top
MCU_USB_C  47.04,32.56 270 top
MCU_VCAP1  41.05,17.29 270 top
MCU_VCAP2  45.28,39.91 90 top
MCU_VDDA_C1  20.16,23.02 180 bottom
MCU_VDDA_C2  20.16,21.91 180 bottom
MCU_VREF1  14.62,23.45 90 top
MCU_VREF2  15.81,23.45 90 top
NRST_R  7.78,41.91 90 top
POWER  53.02,29.37 90 top
POWER1  53.02,29.37 270 bottom
R_LED1  46.51,19.21 180 top
R_LED2  46.51,20.95 180 top
R_LED3  46.51,22.7 180 top
R_LED4  46.51,24.45 180 top
R_REF1  7.94,17.3 0 top
R_REF2  9.21,20.16 90 top
R_USB3  54.13,27.3 270 top
R_USB4  54.13,27.3 270 bottom
R_USB5  53.82,35.56 0 top
R_USB6  53.82,41.91 0 top
SPI_MASTER  37.94,49.69 180 bottom
SPI_SLAVE  25.24,49.69 180 bottom
SWD  7.14,43.02 270 bottom
TLV6002  12.7,18.26 180 top
V_REF  6.35,20.16 90 top
VREG1  58.42,26.35 0 top
X2  53.82,38.73 0 bottom

### Tracks (layer width: path | path; a pad name or v marks a point on that pad's centre or on a via)
+5V_USB
  Top 0.61: X2.1 49.37,37.22 D_USB.A
ADC1_INN2
  Top 0.305: MCU1.50 28.9,17.63 28.57,17.3 28.57,12.22 28.42,12.06
  Top 0.61: CON1.17 21.59,8.41 23.5,10.32 26.67,10.32 28.42,12.06
ADC1_INN16
  Top 0.305: MCU1.35 19.43,21.97 18.26,20.8
  Top 0.61: CON1.5 6.35,11.27 7.62,12.54 15.88,12.54 16.83,13.49 16.83,16.19 17.62,16.99 17.62,20.16 18.26,20.8
ADC1_INN18
  Top 0.305: 22.23,15.72 22.54,15.72 24.4,17.57 MCU1.41
  Top 0.61: CON1.9 11.43,9.68 12.38,10.64 16.51,10.64 18.73,12.86 18.73,15.08 19.37,15.72 22.23,15.72
ADC1_INP2
  Top 0.305: 27.78,13.02 27.94,13.18 27.94,17.62 28.4,18.08 MCU1.49
  Top 0.61: 27.78,13.02 26.04,11.27 21.91,11.27 19.05,8.41 CON1.15
ADC1_INP16
  Top 0.305: MCU1.34 18.66,22.47 17.62,21.43
  Top 0.61: CON1.3 3.81,10.32 6.99,13.49 15.24,13.49 15.88,14.13 15.88,16.67 16.67,17.46 16.67,20.48 17.62,21.43
ADC1_INP18
  Top 0.305: 22.23,16.67 22.54,16.67 23.9,18.03 MCU1.40
  Top 0.61: CON1.7 8.89,10.32 10.16,11.59 16.19,11.59 17.78,13.18 17.78,15.72 18.73,16.67 22.23,16.67
ADC2_INN2
  Top 0.305: MCU1.54 30.9,16.88 32.07,15.72 32.07,12.54 31.91,12.38
  Top 0.61: 31.91,12.38 26.67,7.14 CON1.21
ADC2_INN4
  Top 0.305: MCU1.45 26.4,16.08 26.19,15.88
  Top 0.61: CON1.13 16.51,8.1 20.64,12.22 22.54,12.22 26.19,15.88
ADC2_INN10  (via drill 0.5 pad 1)
  Top 0.305: MCU1.27 10.57,25.97 8.89,25.24 v7.3,25.24
  Bottom 0.61: v7.3,25.24 7.62,24.92 7.62,12.22 8.89,10.95 CON1.8
ADC2_INP2
  Top 0.305: MCU1.53 30.4,16.43 31.43,15.4 31.43,13.34 31.27,13.02
  Top 0.61: 31.27,13.02 27.46,9.37 25.4,9.37 24.13,8.1 CON1.19
ADC2_INP4
  Top 0.305: 25.72,16.67 25.9,16.85 MCU1.44
  Top 0.61: CON1.11 13.97,8.73 14.92,9.68 16.83,9.68 20.32,13.18 22.23,13.18 25.72,16.67
ADC2_INP10  (via drill 0.5 pad 1)
  Top 0.305: MCU1.26 10.12,26.47 9.53,26.19 v8.26,26.19
  Bottom 0.61: CON1.10 11.43,10 8.57,12.86 8.57,25.88 v8.26,26.19
ADC3_INN1  (via drill 0.5 pad 1)
  Top 0.305: MCU1.28 11.03,25.47 8.26,24.29 v6.35,24.29
  Bottom 0.61: v6.35,24.29 6.67,23.97 6.67,10.95 6.35,10.64 CON1.6
ADC3_INN2  (via drill 0.5 pad 1)
  Top 0.305: MCU1.22 13.71,28.47 12.38,27.15 v9.21,27.15
  Bottom 0.61: v9.21,27.15 9.53,26.83 9.53,13.18 13.97,8.73 CON1.12
ADC3_INN3  (via drill 0.5 pad 1)
  Top 0.305: MCU1.20 12.8,29.47 12.38,29.05 v11.11,29.05
  Bottom 0.61: v11.11,29.05 11.43,28.73 11.43,13.81 19.05,6.19 CON1.16
ADC3_INN4  (via drill 0.5 pad 1)
  Top 0.305: MCU1.18 13.5,30.47 v13.02,30.96
  Bottom 0.61: v13.02,30.96 13.34,30.64 13.34,14.45 21.27,6.51 23.5,6.51 24.13,5.87 CON1.20
ADC3_INN5  (via drill 0.5 pad 1)
  Top 0.305: MCU1.14 16.9,32.47 16.19,33.18 v16.19,33.81
  Bottom 0.61: v16.19,33.81 16.19,32.23 15.24,31.27 15.24,15.08 21.91,8.41 24.77,8.41 26.67,6.51 28.42,6.51 29.21,5.71 CON1.24
ADC3_INP1  (via drill 0.5 pad 1)
  Top 0.305: MCU1.29 11.48,24.97 7.94,23.34 v5.4,23.34
  Bottom 0.61: v5.4,23.34 3.81,21.75 CON1.4
ADC3_INP2  (via drill 0.5 pad 1)
  Top 0.305: MCU1.21 13.26,28.97 12.38,28.1 v10.16,28.1
  Bottom 0.61: v10.16,28.1 10.48,27.78 10.48,13.49 11.43,12.54 11.67,12.3 16.51,7.46 CON1.14
ADC3_INP3  (via drill 0.5 pad 1)
  Top 0.305: MCU1.19 12.1,29.97 v12.06,30
  Bottom 0.61: v12.06,30 12.38,29.69 12.38,14.13 21.59,4.92 CON1.18
ADC3_INP4  (via drill 0.5 pad 1)
  Top 0.305: MCU1.15 16.45,31.97 14.92,33.5 v14.92,33.81
  Bottom 0.61: v14.92,33.81 14.92,32.23 14.29,31.59 14.29,14.76 21.59,7.46 24.13,7.46 26.67,4.92 CON1.22
ADC3_INP5  (via drill 0.5 pad 1)
  Top 0.305: MCU1.13 17.83,32.97 17.46,33.34 v17.46,33.81
  Bottom 0.61: v17.46,33.81 17.46,32.23 16.19,30.96 16.19,15.56 22.23,9.53 25.08,9.53 26.83,7.78 29.69,7.78 31.75,5.71 CON1.26
ADC_VREF+
  Top 0.305: MCU1.32 16.8,23.47 16.14,22.8 MCU_VREF2.1
  Top 0.61: MCU_VREF2.1 MCU_VREF1.1 14.71,22.8 13.97,22.07 13.97,20.86 | TLV6002.2 13.97,20.86 | TLV6002.1 13.97,20.86
DGND  (via drill 0.5 pad 1)
  Top 0.305: MCU1.31 16.1,23.97 MCU_VREF2.2 | MCU1.16 15.99,31.47 14.79,32.68 MCU_C2.2 | MCU1.38 22.9,17.98 22.54,17.62 21.27,17.62 | MCU_C1.2 20.32,17.94 20.64,17.62 21.27,17.62 | MCU1.51 29.4,14.97 MCU_C3.2 29.35,13.67 v29.53,13.49 | v34.77,13.65 34.4,14.02 MCU1.61 | 21.27,17.62 v21.27,17.94 | MCU1.94 47.04,31.97 MCU_USB_C.2 | MCU_VCAP2.2 44.57,40.55 | MCU1.120 34.4,42.43 33.66,43.18 | MCU1.143 22.9,42.66 22.54,43.02 21.27,43.02 20.99,42.74 MCU_C5.2 | MCU1.130 29.4,44.42 29.05,44.77 28.58,44.77 MCU_C4.2 28.54,44.77 v26.04,44.77 | MCU1.83 45.36,26.47 46.83,27.94 48.58,27.94 50.58,25.94 LED4.C | MCU1.107 43.39,38.47 43.81,38.89 43.81,40.43 MCU_C7.2
  Top 0.406: C_USB9.1 61.74,38.1 59.53,38.1 58.58,37.15 IC1.13 58.58,34.77 58.26,34.45 C_USB7.1 57.8,33.19 57.32,32.72 X2.M2 53.8,32.7 52.39,32.7 51.11,33.98 X2.4 | C_USB6.1 54.78,39.37 56.99,39.37 57.94,40.32 IC1.5 57.94,43.02 C_USB8.1 57.78,43.04 57.78,44.13 57.16,44.76 X2.M1
  Top 0.61: MCU_VREF2.2 MCU_VREF1.2 13.15,24.11 10.79,22.38 TLV6002.4 10.54,21.11 R_REF2.2 V_REF.2 | C_VDD_3V3_2.2 59.61,26.75 58.42,25.56 VREG1.2 58.42,20.71 C_VDD_3V3_1.2 C_VDD_3V3_3.2 57.15,20.4 57.15,12.54 59.69,10 CON1.47 | v39.69,16.67 41.02,16.67 MCU_VCAP1.2 | 28.1,44.77 v26.04,44.77 22.86,44.77 | SPI_MASTER.1 34.13,44.61 33.66,44.13 33.66,43.66 | 33.66,43.18 33.66,43.66 | 33.66,43.66 v33.02,43.66 | 22.86,44.77 21.43,46.2 SPI_SLAVE.1 | 22.38,44.29 20.99,42.9 MCU_C5.2 | SWD.3 22.38,44.29 | 22.38,44.29 22.86,44.77 | C_USB10.1 59.21,32.72 X2.M2
  Bottom 0.61: MCU_VDDA_C2.2 MCU_VDDA_C1.2 21.27,23.02 | 21.27,23.02 v21.27,17.94 25.24,17.94 v29.53,13.49 34.61,13.49 v34.77,13.65 | 21.27,23.02 21.27,24.45 20.32,25.4 18.73,25.4 17.3,26.83 17.3,30.8 18.89,32.38 18.89,34.13 17.62,35.4 15.08,35.4 | MCU_C6.2 33.81,14.61 v34.77,13.65 | v39.69,16.67 39.69,15.08 38.26,13.65 v34.77,13.65 | v33.02,43.66 33.02,44.77 v26.04,44.77
  other vias: 44.29,42.07
  pour Top (isolate 0.61): 0,0 63.5,0 63.5,53.82 0,53.82
  pour Bottom (isolate 0.61): 0,0 63.5,0 63.5,53.82 0,53.82
GPIO_EXTI15_EMERGENCY_STOP
  Top 0.305: MCU1.55 31.4,17.34 32.7,16.03 32.7,11.59 32.54,11.43
  Top 0.61: 32.54,11.43 29.21,8.1 CON1.23
LED_1
  Top 0.305: MCU1.73 43.6,21.47 R_LED1.2
LED_2
  Top 0.305: MCU1.74 44.85,21.97 R_LED2.2
LED_3
  Top 0.305: MCU1.78 44.59,23.97 R_LED3.2
LED_4
  Top 0.305: MCU1.79 45.84,24.47 R_LED4.2
MCU_VCAP_1
  Top 0.305: MCU1.71 39.4,18.23 39.85,17.78 40.89,17.78 MCU_VCAP1.1
MCU_VCAP_2
  Top 0.305: MCU1.106 44.64,37.97 45.24,38.58 45.24,39.22 MCU_VCAP2.1
N$2
  Top 0.305: R_LED4.1 LED4.A
N$7
  Bottom 0.61: R_USB4.1 54.13,29.31 POWER1.A
N$11
  Top 0.305: R_LED3.1 LED3.A
N$12
  Top 0.406: IC1.10 IC1.11 56.99,36.34 56.99,38.1 | 56.99,38.1 59.21,40.32 IC1.3 | C_USB6.2 56.98,38.09 56.99,38.1
N$15  (via drill 0.5 pad 1)
  Top 0.61: D_USB.C 49.37,28.89 51.61,26.66 v52.55,26.66 R_USB4.2 56.11,24.68 VREG1.1
  Top 0.813: VREG1.1 55.32,22.47 C_VDD_3V3_3.1 55.32,11.05 D_POWER.K
  Bottom 0.61: R_USB4.2 v52.55,26.66
N$16
  Top 0.406: C_USB8.2 56.04,42.56 IC1.8 55.58,41.91 R_USB6.2
N$17
  Top 0.406: C_USB7.2 56.04,34.91 IC1.9 55.58,35.56 R_USB5.2
N$133
  Top 0.406: R_USB5.1 53.17,38.12 52.55,38.73 49.69,38.73 49.11,39.32 X2.2
N$134
  Top 0.406: R_USB6.1 51.91,41.91 51.12,41.12 51.12,40 X2.3
N$138
  Top 0.61: R_USB3.1 54.13,29.31 POWER.A
N$144
  Top 0.61: TLV6002.3 12.06,19.21 11.75,18.89 9.53,18.89 R_REF2.1 V_REF.1 6.99,18.75 R_REF1.1
N$147
  Top 0.305: R_LED1.1 LED1.A
N$154
  Top 0.305: R_LED2.1 LED2.A
NRST  (via drill 0.5 pad 1)
  Top 0.305: MCU1.25 18.91,26.97 v18.41,27.46
  Top 0.61: NRST_R.1 7.78,40.16 8.73,39.21 SWD.5
  Bottom 0.61: v18.41,27.46 18.41,30.48 19.84,31.91 19.84,34.61 15.24,39.21 SWD.5
SPI3_MISO
  Top 0.305: MCU1.112 38.4,44.15 37.94,44.61
  Top 0.406: 37.94,44.61 37.94,51.28 38.58,51.91 41.12,51.91 41.75,51.28 SPI_MASTER.4
SPI3_MOSI
  Top 0.305: MCU1.113 37.9,43.06 36.67,44.29
  Top 0.61: 36.67,44.29 SPI_MASTER.2
SPI3_SCK
  Top 0.305: 39.21,44.29 38.9,43.98 MCU1.111
  Top 0.61: SPI_MASTER.3 39.21,44.29
SPI6_MISO
  Top 0.305: MCU1.127 30.9,42.81 31.19,43.1
  Top 0.406: SPI_SLAVE.2 23.97,51.28 25.24,52.55 30.8,52.55 31.43,51.91 31.43,43.34 31.19,43.1
SPI6_MOSI
  Top 0.305: MCU1.129 29.9,45.35 29.53,45.72
  Top 0.61: 29.53,45.72 29.05,46.2 SPI_SLAVE.4
SPI6_SCK
  Top 0.305: MCU1.128 30.4,43.26 30.64,43.5
  Top 0.406: SPI_SLAVE.3 26.51,51.44 26.99,51.91 30,51.91 30.64,51.28 30.64,43.5
SYS_JTCK_SWCLK  (via drill 0.5 pad 1)
  Top 0.305: 40.96,41.98 MCU1.109
  Top 0.406: v40.96,45.56 40.96,41.98
  Top 0.61: SWD.2 v18.89,46.83
  Bottom 0.61: v18.89,46.83 39.69,46.83 v40.96,45.56
SYS_JTDO_SWO  (via drill 0.5 pad 1)
  Top 0.305: MCU1.133 27.9,42.42 27.3,43.02 v26.04,43.02
  Bottom 0.61: v26.04,43.02 8.89,43.02 8.1,42.23 8.1,37.47 8.89,36.67 SWD.6
SYS_JTMS_SWDIO  (via drill 0.5 pad 1)
  Top 0.305: MCU1.105 43.49,37.47 v44.13,36.83
  Bottom 0.61: v44.13,36.83 19.68,36.83 14.76,41.75 SWD.4
TIM1_BKIN
  Top 0.305: MCU1.68 37.9,17.03 41.12,13.81 41.12,13.49
  Top 0.61: 41.12,13.49 41.12,12.54 46.99,6.67 CON1.37
TIM1_BKIN2  (via drill 0.5 pad 1)
  Top 0.305: MCU1.89 v46.89,29.47
  Top 0.61: v49.85,13.81 49.53,13.49 CON1.39
  Bottom 0.61: v46.89,29.47 47.2,29.47 49.37,27.3 49.37,14.29 v49.85,13.81
TIM1_CH1
  Top 0.305: MCU1.60 33.9,10.39 34.13,10.16
  Top 0.61: 34.13,10.16 34.29,10 CON1.27
TIM1_CH1N
  Top 0.305: MCU1.59 33.4,10.7 33.18,10.48
  Top 0.61: 33.18,10.48 31.75,9.05 CON1.25
TIM1_CH2
  Top 0.305: MCU1.64 35.9,16.64 37.94,14.61 37.94,14.29
  Top 0.61: CON1.31 39.37,7.62 37.94,9.05 37.94,14.29
TIM1_CH2N
  Top 0.305: MCU1.63 35.4,16.35 36.83,14.92 36.83,14.61
  Top 0.61: 36.83,14.61 CON1.29
TIM1_CH3
  Top 0.305: MCU1.66 36.9,17.23 40.01,14.13 40.01,13.81
  Top 0.61: 40.01,13.81 40.01,11.27 44.45,6.83 CON1.35
TIM1_CH3N
  Top 0.305: MCU1.65 36.4,16.94 39.05,14.29 39.05,13.97
  Top 0.61: 39.05,13.97 39.05,10 41.91,7.14 CON1.33
TIM4_CH1_ENCODER  (via drill 0.5 pad 1)
  Top 0.305: MCU1.81 47.38,25.47 48.1,26.19 v48.1,26.51
  Bottom 0.61: v48.1,26.51 48.1,13.65 49.85,11.91 56.04,11.91 59.69,8.26 CON1.48
TIM4_CH2_ENCODER  (via drill 0.5 pad 1)
  Top 0.305: MCU1.82 46.13,25.97 v46.67,26.51
  Bottom 0.61: v46.67,26.51 46.67,13.34 49.21,10.79 52.55,10.79 57.15,6.19 CON1.46
TIM5_CH4_TACOMETRO  (via drill 0.5 pad 1)
  Top 0.305: 22.4,19.07 MCU1.37 v18.73,19.53
  Bottom 0.61: v18.73,19.53 18.73,14.76 22.7,10.79 25.24,10.79 26.67,9.37 32.38,9.37 34.29,7.46 CON1.28
TIM8_BKIN  (via drill 0.5 pad 1)
  Top 0.305: MCU1.87 43.92,28.47 v44.29,28.1
  Bottom 0.61: v44.29,28.1 43.97,27.78 43.97,12.7 48.42,8.26 49.53,8.26 52.07,5.71 CON1.42
TIM8_BKIN2  (via drill 0.5 pad 1)
  Top 0.305: MCU1.88 45.16,28.97 45.56,28.57 v45.56,28.1
  Bottom 0.61: v45.56,28.1 45.4,27.78 45.4,12.86 48.74,9.53 50.64,9.53 54.61,5.56 CON1.44 54.61,4.92
TIM8_CH1  (via drill 0.5 pad 1)
  Top 0.305: v44.77,33.34 44.4,32.97 MCU1.96
  Bottom 0.61: v44.77,33.34 40.96,29.53 40.96,10.32 44.45,6.83 CON1.36
TIM8_CH1N  (via drill 0.5 pad 1)
  Top 0.305: MCU1.43 25.4,17.62 25.08,17.3
  Top 0.406: 25.08,17.3 22.23,14.45 v21.75,14.45
  Bottom 0.61: v21.75,14.45 23.02,14.45 27.15,10.32 33.97,10.32 36.83,7.46 CON1.30
TIM8_CH2  (via drill 0.5 pad 1)
  Top 0.305: v45.88,34.29 44.29,34.29 43.47,33.47 MCU1.97
  Bottom 0.61: v45.88,34.29 45.88,32.86 41.91,28.89 41.91,11.75 46.99,6.67 CON1.38
TIM8_CH2N  (via drill 0.5 pad 1)
  Top 0.305: MCU1.46 26.9,15.31 26.67,15.08
  Top 0.61: v25.72,13.81 25.72,14.13 26.67,15.08
  Bottom 0.61: v25.72,13.81 25.72,13.34 27.78,11.27 35.08,11.27 39.37,6.99 CON1.32
TIM8_CH3  (via drill 0.5 pad 1)
  Top 0.305: MCU1.98 43.18,33.97 44.77,35.56 v45.88,35.56
  Bottom 0.61: v45.88,35.56 46.67,35.56 47.15,35.08 47.15,32.7 42.86,28.42 42.86,12.22 47.94,7.14 48.9,7.14 49.53,6.51 CON1.40
TIM8_CH3N  (via drill 0.5 pad 1)
  Top 0.305: MCU1.47 27.4,14.22 27.15,13.97
  Top 0.61: 27.15,13.97 v26.99,13.81
  Bottom 0.61: v26.99,13.81 28.57,12.22 35.88,12.22 41.91,6.19 CON1.34
UART4_RX  (via drill 0.5 pad 1)
  Top 0.305: MCU1.114 37.4,42.77 36.67,43.5 36.2,43.5 35.56,44.13 v35.56,44.77
  Top 0.406: v60.8,45.88 60.48,45.56 IC1.1
  Bottom 0.61: v60.8,45.88 60.8,46.51 58.9,48.42 51.12,48.42 47.15,44.45 40.16,44.45 39.85,44.77 v35.56,44.77
UART4_TX  (via drill 0.5 pad 1)
  Top 0.305: MCU1.115 36.9,42.47 36.51,42.86 35.08,42.86 34.77,43.18 v34.77,43.5
  Top 0.406: v58.74,45.88 58.58,45.72 IC1.4
  Bottom 0.61: v34.77,43.5 47.94,43.5 51.75,47.31 57.31,47.31 v58.74,45.88
VDD_3V3  (via drill 0.5 pad 1)  (1 unrouted)
  Top 0.305: 23.88,22.98 23.89,23 | 23.89,23 24.35,23.45 | 24.35,23.45 29.9,29.01 | 29.9,29.01 31.08,30.19 | 33.9,33.01 39.87,38.97 MCU1.108 41.85,40.3 MCU_C7.1 | MCU1.121 33.9,37.51 | 33.9,37.51 34,37.41 | 28.9,37.57 MCU1.131 28.9,43.11 MCU_C4.1 | 28.9,37.57 29.06,37.41 | 24.8,36.47 22.4,38.87 MCU1.144 22.32,41 MCU_C5.1 | 24.8,36.47 30,31.27 | 30,31.27 30.41,30.86 | 30.41,30.86 31.08,30.19 | MCU1.6 24.8,36.47 | MCU1.30 23.81,24.47 24.35,23.45 | 34.9,22.81 MCU1.62 34.9,15.42 v35.4,14.92 | 34.9,22.81 34.9,22.33 | MCU1.72 39.9,21.37 38.41,22.86 34.9,26.37 | 34.3,26.97 31.08,30.19 | MCU1.84 38.47,26.97 | 38.47,26.97 38.4,27.05 | MCU_C2.1 14.7,30.97 MCU1.17 23.57,30.97 23.67,30.86 30.41,30.86 | 30.46,14.59 MCU_C3.1 30.65,15.22 29.9,15.98 MCU1.52 29.9,29.01 | MCU1.33 17.89,22.97 v17.46,22.54 | MCU1.33 | MCU1.33 23.81,22.97 | 23.81,22.97 23.89,22.97 23.89,23 | MCU_USB_C.1 46.3,33.2 45.57,32.47 MCU1.95 38.3,32.47 38.27,32.44 33.33,32.44 | MCU1.39 23.4,22.56 23.81,22.97 | 33.9,37.51 33.9,33.01 | 33.33,32.44 31.08,30.19 | 28.9,37.57 28.9,32.37 30,31.27 | 38.47,26.97 34.3,26.97 | 34.9,22.81 34.9,26.37 | 34.9,26.37 34.3,26.97 | 33.9,33.01 33.33,32.44
  Top 0.406: 23.88,22.98 23.3,22.51 20.97,20.18 MCU_C1.1 | IC1.12 57.94,37.78 59.53,39.37 61.74,39.37 C_USB9.2 | 7.94,43.02 7.78,43.18
  Top 0.61: TLV6002.8 14.61,17.3 14.29,17.62 | 14.29,17.62 9.21,17.62 R_REF1.2 | C_VDD_3V3_2.1 62.71,24.13 | v50.64,16.51 44.76,16.51 38.41,22.86 | v17.46,22.54 15.72,20.8 15.72,18.73 14.61,17.62 14.29,17.62 | NRST_R.2 7.78,43.18 7.78,48.42 8.73,49.37 SWD.1 | MCU_C5.1 17.42,41 15.4,43.02 7.94,43.02 | C_USB9.2 62.37,39.38 62.87,38.89 62.87,33.66 | 62.87,33.66 62.87,32.23 v62.23,31.59 | C_USB10.2 62.87,33.66
  Top 0.813: C_VDD_3V3_1.1 60.73,20.8 VREG1.3 61.83,23.25 62.71,24.13 | C_VDD_3V3_2.1 62.71,21.75 v62.23,21.27
  Bottom 0.61: MCU_VDDA_C2.1 MCU_VDDA_C1.1 19.51,22.54 v17.46,22.54 | MCU_C6.1 35.03,15.93 35.4,15.56 v35.4,14.92 | v50.64,16.51 57.47,16.51 v62.23,21.27 v62.23,31.59
VDD_5V  (1 unrouted)
  Top 0.61: D_POWER.A 62.23,8.24
  Top 0.813: 62.23,8.24 CON1.49
(copper drawn outside any net)
  shapes: Top area x3